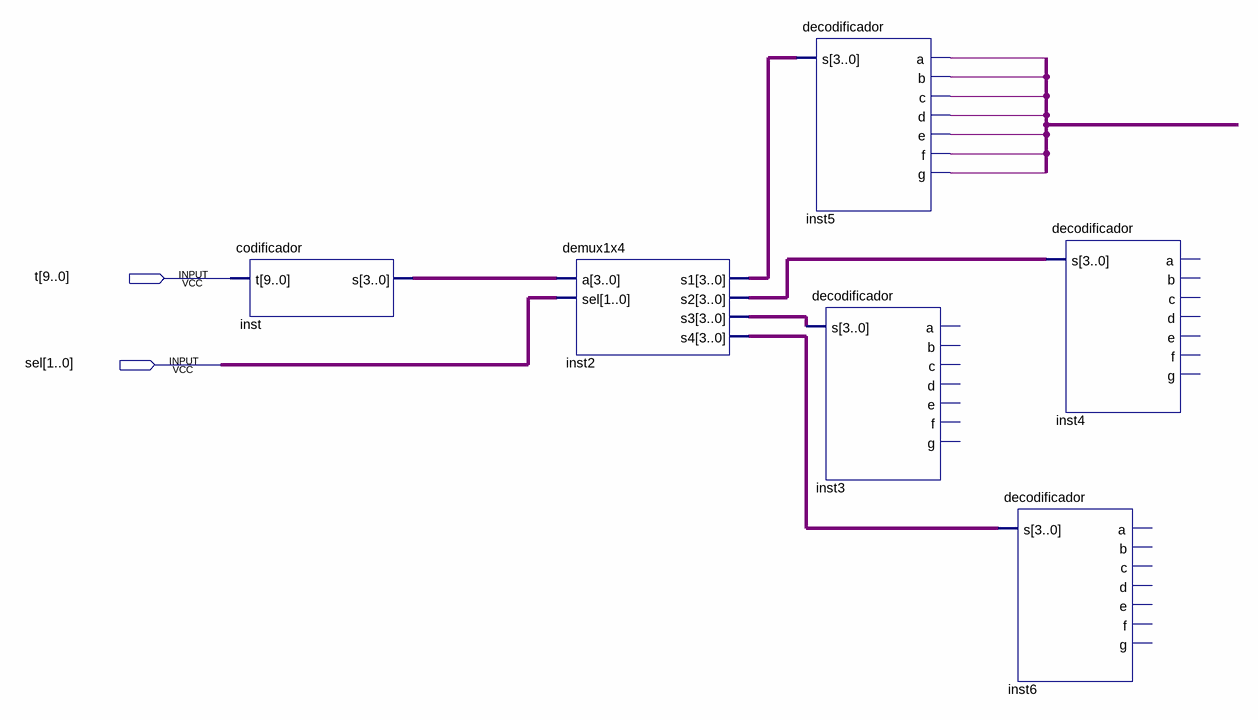
[diagram p0: schematic sheet]
// Quartus schematic relogioDigital.bdf as structural Verilog: 6 symbols, 2 pins
module relogioDigital (
  input  [9:0] t,
  input  [1:0] sel
);

  wire inst5_a;
  wire [3:0] inst2_s1, inst2_s2, inst2_s3, inst2_s4, inst_s;

  codificador inst (.t(t), .s(inst_s));
  demux1x4 inst2 (.a(inst_s), .sel(sel), .s1(inst2_s1), .s2(inst2_s2), .s3(inst2_s3), .s4(inst2_s4));
  decodificador inst5 (
    .s(inst2_s1), .a(inst5_a), .b(inst5_a), .c(inst5_a), .d(inst5_a), .e(inst5_a), .f(inst5_a), .g(inst5_a));
  decodificador inst3 (.s(inst2_s3));  // open: a, b, c, d, e, f, g
  decodificador inst4 (.s(inst2_s2));  // open: a, b, c, d, e, f, g
  decodificador inst6 (.s(inst2_s4));  // open: a, b, c, d, e, f, g
endmodule
